# Altium schematic sheet schematic.SchDoc
size 297 x 209 mm; SheetNumber: 1; SheetTotal: 1
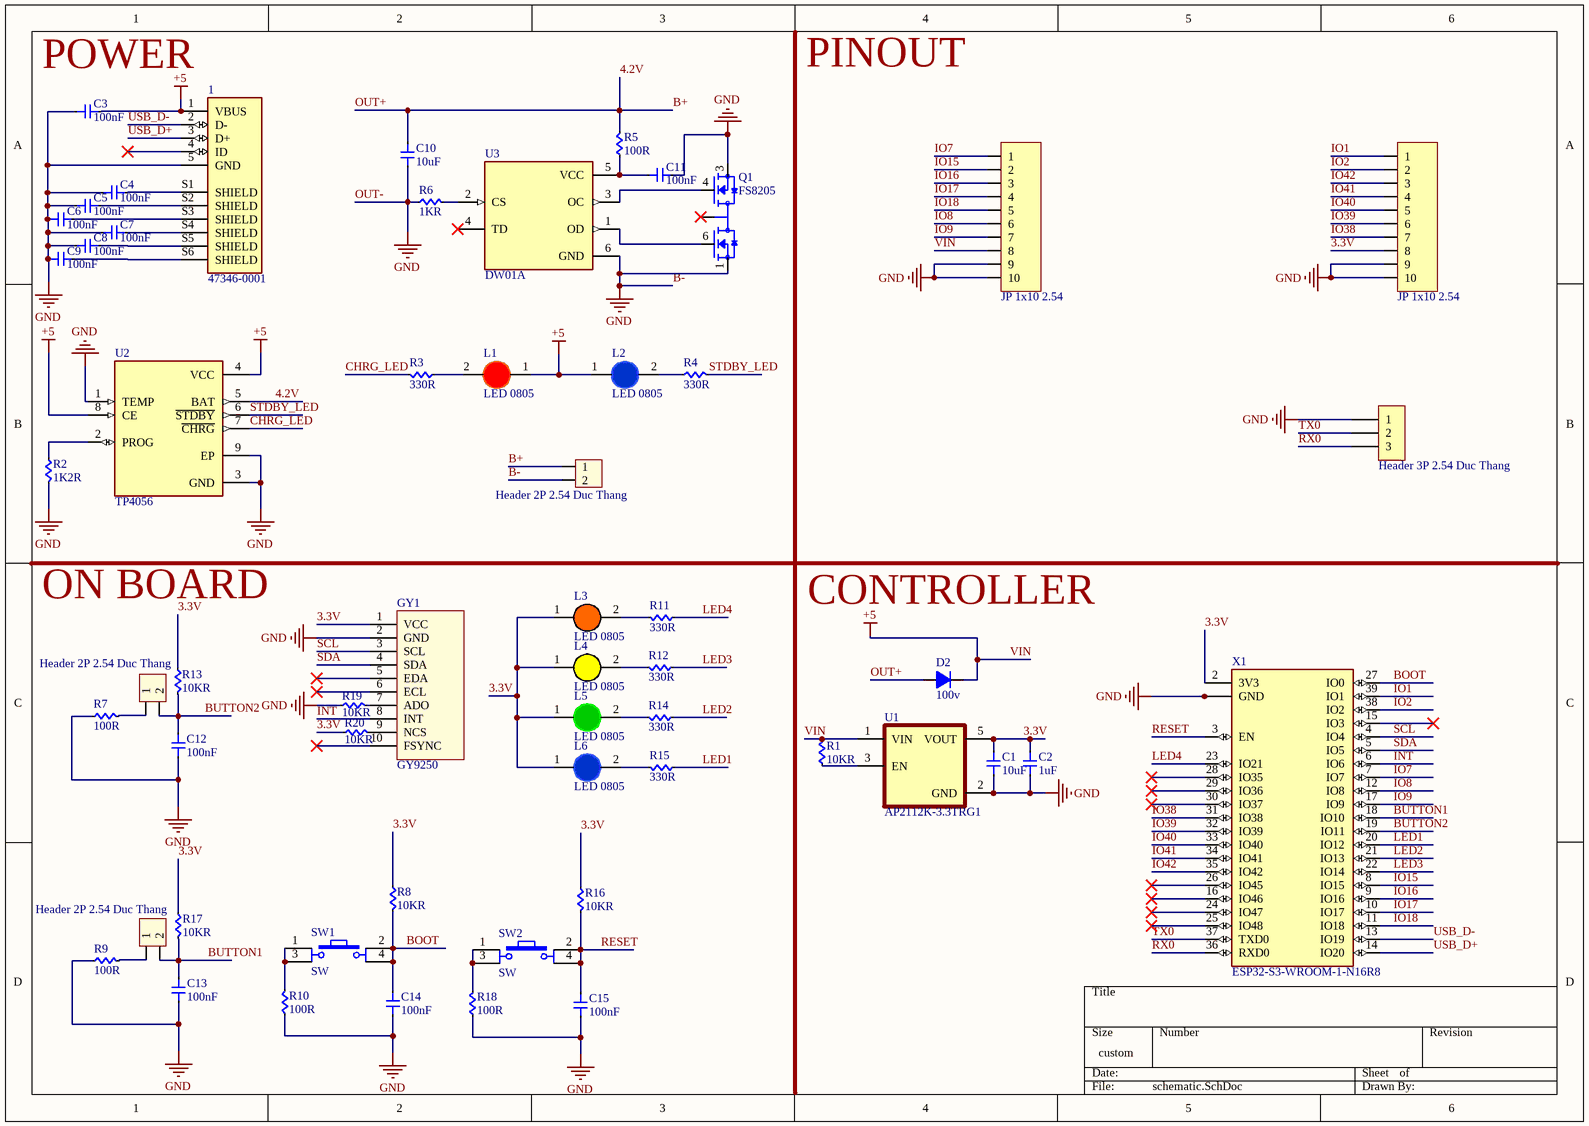
[diagram p0: schematic.SchDoc]

## Parts
1  47346-0001  [MOLEX_47346-0001]
C1  10uF  [Cap 1206]
C2  1uF  [Cap 1206]
C3  100nF  [Cap 1206]
C4  100nF  [Cap 1206]
C5  100nF  [Cap 1206]
C6  100nF  [Cap 1206]
C7  100nF  [Cap 1206]
C8  100nF  [Cap 1206]
C9  100nF  [Cap 1206]
C10  10uF  [Cap 1206]
C11  100nF  [Cap 1206]
C12  100nF  [Cap 1206]
C13  100nF  [Cap 1206]
C14  100nF  [Cap 1206]
C15  100nF  [Cap 1206]
D2  100v  [DIODE 1A]
GY1  GY9250  [GY9250]
H1  Header 2P 2.54 Duc Thang  [XH2.54M-2]
H2  Header 2P 2.54 Duc Thang  [XH2.54M-2]
H3  Header 2P 2.54 Duc Thang  [XH2.54M-2]
H4  Header 3P 2.54 Duc Thang  [XH2.54M-3]
JP1  JP 1x10 2.54  [JP 1x10 DT]
JP2  JP 1x10 2.54  [JP 1x10 DT]
L1  LED 0805  [LED-0805-Red]
L2  LED 0805  [LED-0805-Blue]
L3  LED 0805  [LED-0805-Orange]
L4  LED 0805  [LED-0805-Yellow]
L5  LED 0805  [LED-0805-Green]
L6  LED 0805  [LED-0805-Blue]
Q1  FS8205  [SOT95P280X145-6N]
R1  10KR  [RES 1206]
R2  1K2R  [RES 1206]
R3  330R  [RES 1206]
R4  330R  [RES 1206]
R5  100R  [RES 1206]
R6  1KR  [RES 1206]
R7  100R  [RES 1206]
R8  10KR  [RES 1206]
R9  100R  [RES 1206]
R10  100R  [RES 1206]
R11  330R  [RES 1206]
R12  330R  [RES 1206]
R13  10KR  [RES 1206]
R14  330R  [RES 1206]
R15  330R  [RES 1206]
R16  10KR  [RES 1206]
R17  10KR  [RES 1206]
R18  100R  [RES 1206]
R19  10KR  [RES 1206]
R20  10KR  [RES 1206]
SW1  SW  [SW4]
SW2  SW  [SW4]
U1  AP2112K-3.3TRG1  [SOT95P285X140-5N]
U2  TP4056  [SOP127P600X175-9N]
U3  DW01A  [SOT95P280X145-6N]
X1  ESP32-S3-WROOM-1-N16R8  [ESP32S3WROOM1N8R2]

## Nets
B-: 1.5(GND) C1.2 C2.2 C3.2 C4.2 C5.2 C6.2 C7.2 C8.2 C9.2 C10.2 C11.1 C12.2 C13.2 C14.2 C15.2 GY1.2(GND) H1.2 H4.1 JP1.9 JP1.10 JP2.9 JP2.10 Q1.1(S1) Q1.3(S2) R2.2 R6.1 R7.1 R9.1 R10.1 R18.1 R19.1 U1.2(GND) U2.1(TEMP) U2.3(GND) U2.9(EP) U3.6(GND) X1.1(GND) X1.40(GND) X1.41(GND) X1.42(GND) X1.43(GND) X1.44(GND) X1.45(GND) X1.46(GND) X1.47(GND) X1.48(GND) X1.49(GND)  [also labelled GND, OUT-]
VIN: 1.1(VBUS) C3.1 D2.2(K) JP1.8 L1.1(A) L2.1(A) R1.2 U1.1(VIN) U2.4(VCC) U2.8(CE)  [also labelled +5]
3.3V: C1.1 C2.1 GY1.1(VCC) JP2.8 L3.1(A) L4.1(A) L5.1(A) L6.1(A) R8.1 R13.1 R16.1 R17.1 R20.1 U1.5(VOUT) X1.2(3V3)
4.2V: C10.1 D2.1(A) H1.1 R5.2 U2.5(BAT)  [also labelled B+, OUT+]
BOOT: C14.1 R8.2 SW1.2 SW1.4 X1.27(IO0)
BUTTON1: C13.1 H3.2 R17.2 X1.18(IO10)
BUTTON2: C12.1 H2.2 R13.2 X1.19(IO11)
CHRG_LED: R3.2 U2.7(~{CHRG})
INT: GY1.8(INT) X1.6(IO6)
IO1: JP2.1 X1.39(IO1)
IO2: JP2.2 X1.38(IO2)
IO7: JP1.1 X1.7(IO7)
IO8: JP1.6 X1.12(IO8)
IO9: JP1.7 X1.17(IO9)
IO15: JP1.2 X1.8(IO15)
IO16: JP1.3 X1.9(IO16)
IO17: JP1.4 X1.10(IO17)
IO18: JP1.5 X1.11(IO18)
IO38: JP2.7 X1.31(IO38)
IO39: JP2.6 X1.32(IO39)
IO40: JP2.5 X1.33(IO40)
IO41: JP2.4 X1.34(IO41)
IO42: JP2.3 X1.35(IO42)
LED1: R15.1 X1.20(IO12)
LED2: R14.1 X1.21(IO13)
LED3: R12.1 X1.22(IO14)
LED4: R11.1 X1.23(IO21)
RESET: C15.1 R16.2 SW2.2 SW2.4 X1.3(EN)
RX0: H4.3 X1.36(RXD0)
SCL: GY1.3(SCL) X1.4(IO4)
SDA: GY1.4(SDA) X1.5(IO5)
STDBY_LED: R4.2 U2.6(~{STDBY})
TX0: H4.2 X1.37(TXD0)
USB_D+: 1.3(D+) X1.14(IO20)
USB_D-: 1.2(D-) X1.13(IO19)
Net1_S1: 1.S1(SHIELD) C4.1
Net1_S2: 1.S2(SHIELD) C5.1
Net1_S3: 1.S3(SHIELD) C6.1
Net1_S4: 1.S4(SHIELD) C7.1
Net1_S5: 1.S5(SHIELD) C8.1
Net1_S6: 1.S6(SHIELD) C9.1
NetC11_2: C11.2 R5.1 U3.5(VCC)
NetGY1_7: GY1.7(ADO) R19.2
NetGY1_9: GY1.9(NCS) R20.2
NetH2_1: H2.1 R7.2
NetH3_1: H3.1 R9.2
NetL1_2: L1.2(K) R3.1
NetL2_2: L2.2(K) R4.1
NetL3_2: L3.2(K) R11.2
NetL4_2: L4.2(K) R12.2
NetL5_2: L5.2(K) R14.2
NetL6_2: L6.2(K) R15.2
NetQ1_2: Q1.2(D12) Q1.5(D12)
NetQ1_4: Q1.4(G2) U3.3(OC)
NetQ1_6: Q1.6(G1) U3.1(OD)
NetR1_1: R1.1 U1.3(EN)
NetR2_1: R2.1 U2.2(PROG)
NetR6_2: R6.2 U3.2(CS)
NetR10_2: R10.2 SW1.1 SW1.3
NetR18_2: R18.2 SW2.1 SW2.3

Not connected (* = marked no-connect by the designer): 1 4(ID)*; GY1 5(EDA)* 6(ECL)* 10(FSYNC)*; U3 4(TD)*; X1 15(IO3)* 16(IO46)* 24(IO47)* 25(IO48)* 26(IO45)* 28(IO35)* 29(IO36)* 30(IO37)*

## Notes on the sheet
- (near C3) POWER
- PINOUT
- ON BOARD
- CONTROLLER

## Library data of the parts
1 = 47346-0001: Conn Data USB Micro B w/Flange SMT Bottom Mnt LF | Molex Incorporated 47346-0001; SnapEDA_Link: https://www.snapeda.com/parts/47346-0001/Molex/view-part/?ref=snap; Package: None; Value: *; MF: Molex; MP: 47346-0001; Check_prices: https://www.snapeda.com/parts/47346-0001/Molex/view-part/?ref=eda
C1-C15 = Cap 1206: Capacitor SMD 1206
D2 = Diode 1N4007: Cắm; Ten_Linh_Kien: Diode 1N4007 1A (DIP); Don_Vi: Con; Ma_Hang: MH001063; Ghi Chu: *; Kieu_Chan: *; Chung_Loai: Cắm
H1-H3 = Header 2P 2.54 Duc Thang: Cắm; Ten_Linh_Kien: Header 2P XH2.54-2P Đực Thẳng; Don_Vi: Con; Ma_Hang: MH001283; Chung_Loai: Cắm
H4 = Header 3P 2.54 Duc Thang: Cắm; Ten_Linh_Kien: Header 3P XH2.54-3P Đực Thẳng; Don_Vi: Con; Ma_Hang: MH001292; Chung_Loai: Cắm
JP1 JP2 = JP 1x10 2.54 Duc Thang: Cắm; Ten_Linh_Kien: Jump Đơn Đực 2.54MM 1x40P Thẳng 11MM; Don_Vi: Con; Ma_Hang: MH000903; Ghi_Chu: *; Kieu_Chan: *; Chung_Loai: Cắm
L1 = LED 0805 Do: Dán; Don_Vi: Con; Ma_Hang: MH000897; Ten_Linh_Kien: LED 0805 Màu Đỏ (Red); Ghi_Chu: *; Kieu_Chan: *; Chung_Loai: Dán
L2 L6 = LED 0805 Xanh Duong: Dán; Don_Vi: Con; Ma_Hang: MH002327; Ten_Linh_Kien: LED 0805 Màu Xanh Dương (Blue); Ghi_Chu: *; Kieu_Chan: *; Chung_Loai: Dán
L3 = LED 0805 Cam: Dán; Don_Vi: Con; Ma_Hang: MH002328; Ten_Linh_Kien: LED 0805 Màu Cam ( Orange); Ghi_Chu: *; Kieu_Chan: *; Chung_Loai: Dán
L4 = LED 0805 Vang: Dán; Don_Vi: Con; Ma_Hang: MH002329; Ten_Linh_Kien: LED 0805 Màu Vàng ( Yellow); Ghi_Chu: *; Kieu_Chan: *; Chung_Loai: Dán
L5 = LED 0805 Xanh La: Dán; Don_Vi: Con; Ma_Hang: MH002326; Ten_Linh_Kien: LED 0805 Màu Xanh Lá (Green); Ghi_Chu: *; Kieu_Chan: *; Chung_Loai: Dán
Q1 = FS8205: ÐœÐžÐŸ-Ñ‚Ñ€Ð°Ð½Ð·Ð¸ÑÑ‚Ð¾Ñ€ Ñ Ð´Ð²Ð¾Ð¹Ð½Ñ‹Ð¼ N-ÐºÐ°Ð½Ð°Ð»ÑŒÐ½Ñ‹Ð¼ Ñ€ÐµÐ¶Ð¸Ð¼Ð¾Ð¼ ÑƒÑÐ¸Ð»ÐµÐ½Ð¸Ñ Ð¼Ð¾Ñ‰Ð½Ð¾ÑÑ‚Ð¸; MF: Fortune Semiconductor; SnapEDA_Link: https://www.snapeda.com/parts/FS8205/Fortune+Semiconductor/view-part/?ref=snap; Package: Package; Value: *; MP: FS8205; Check_prices: https://www.snapeda.com/parts/FS8205/Fortune+Semiconductor/view-part/?ref=eda
R1-R20 = RES 1206: RES SMD 1206; Manufacturer: Vishay Dale; Manufacturer Part Number: CRCW040210K0FKED; Resistance (Ohms): 10k; Tolerance: ±1%; Power (Watts): 0.063W, 1/16W; Temperature Coefficient: ±100ppm/°C; Supplier 1: Digi-Key; RoHS: RoHS Compliant; Category: Resistors; Stock 1: 2392462; Pricing 1: 10=0.083, 50=0.0444, 200=0.0255, 1000=0.0174 (USD); Packaging: Cut Tape (CT); Composition: Thick Film; Features: Automotive AEC-Q200; Operating Temperature: -55°C ~ 155°C; Package / Case: 0402 (1005 Metric); Supplier Device Package: 0402 (1005 Metric); Size / Dimension: 0.039" L x 0.020" W (1.00mm x 0.50mm); Height: 0.016" (0.40mm); Number of Terminations: 2; ComponentLink1URL: http://www.vishay.com/docs/20035/dcrcwe3.pdf; ComponentLink1Description: http://www.vishay.com/docs/20035/dcrcwe3.pdf; Supplier Part Number 1: 541-10.0KLCT-ND
SW1 SW2 = SW4: Switch button 4 pin; Value: Button chip 4 pin
U1 = AP2112K-3.3TRG1: Linear Voltage Regulator IC Positive Fixed 1 Output 600mA SOT-25; MF: Diodes Inc.; Value: *; Purchase-URL: https://pricing.snapeda.com/search/part/AP2112K-3.3TRG1/?ref=eda; Package: SOT-753 Diodes Inc.; Availability: In Stock; Check_prices: https://www.snapeda.com/parts/AP2112K-3.3TRG1/Diodes+Inc./view-part/?ref=eda; Price: None; SnapEDA_Link: https://www.snapeda.com/parts/AP2112K-3.3TRG1/Diodes+Inc./view-part/?ref=snap; MP: AP2112K-3.3TRG1
U2 = TP4056: Complete single cell Li-Ion battery with a constant current / constant voltage linear charger; MF: NanJing Top Power ASIC Corp.; Check_prices: https://www.snapeda.com/parts/TP4056/NanJing+Top+Power+ASIC+Corp./view-part/?ref=eda; SnapEDA_Link: https://www.snapeda.com/parts/TP4056/NanJing+Top+Power+ASIC+Corp./view-part/?ref=snap; Price: None; Availability: Not in stock; Package: Package; MP: TP4056; Value: *
U3 = DW01A: One Cell Lithium-ion/Polymer Battery Protection IC; MF: Fortune Semiconductor; SnapEDA_Link: https://www.snapeda.com/parts/DW01A/Fortune+Semiconductor/view-part/?ref=snap; Package: SOT-23-6 Fortune Semiconductor; Value: *; MP: DW01A; Check_prices: https://www.snapeda.com/parts/DW01A/Fortune+Semiconductor/view-part/?ref=eda
X1 = ESP32-S3-WROOM-1-N16R8: Bluetooth, WiFi 802.11b/g/n, Bluetooth v5.0 Transceiver Module 2.4GHz PCB Trace Surface Mount; MF: Espressif Systems; SnapEDA_Link: https://www.snapeda.com/parts/ESP32-S3-WROOM-1-N16R8/Espressif+Systems/view-part/?ref=snap; Package: NON STANDARD Espressif Systems; Value: *; MP: ESP32-S3-WROOM-1-N16R8; Check_prices: https://www.snapeda.com/parts/ESP32-S3-WROOM-1-N16R8/Espressif+Systems/view-part/?ref=eda